# EAGLE design RC_prueba (EAGLE 7.1.0)
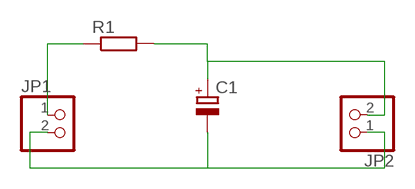
[diagram p0: schematic, sheet 1]

## Parts
C1  CPOL-EUA/3216-18R  [A/3216-18R]
JP1  PINHD-1X2  [1X02]
JP2  PINHD-1X2  [1X02]
R1  R-EU_MELF0204W  [MINI_MELF-0204W]

## Nets
N$1: JP1.1 R1.1
N$2: C1.+ JP2.2 R1.2
N$4: C1.- JP1.2 JP2.1

## Library data of the parts
C1 = rcl:CPOL-EU: POLARIZED CAPACITOR, European symbol
JP1 JP2 = pinhead:PINHD-1X2: PIN HEADER
R1 = rcl:R-EU_: RESISTOR, European symbol

## Board
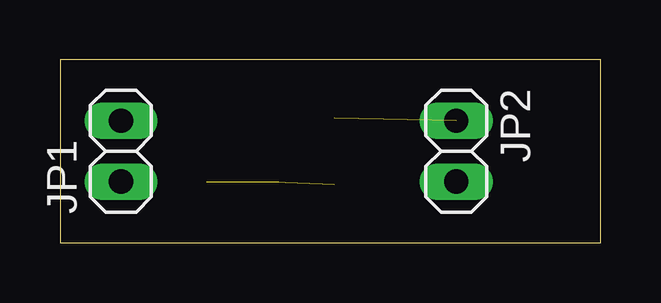
[diagram p1: board, top side]
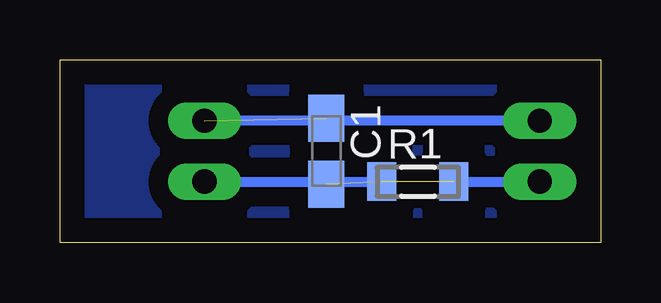
[diagram p2: board, bottom side, seen from below]

Size 22.53 x 7.61 mm. Coordinates in mm from the lower left corner, seen from the top.
Outline: 0,0 22.53,0 22.53,7.61 0,7.61 0,0
Copper layers (1*16): Top 0.035mm / dielectric 1.5mm / Bottom 0.035mm
Design rules "default": minimum track width 10mil, minimum drill 24mil, track to track 8mil, track to pad 8mil, pad to pad 8mil, via to via 8mil, smd to smd 8mil, copper to edge 40mil, drill to drill 8mil, minimum pad ring 10mil, minimum via ring 8mil, stop-mask expansion 4mil, vias tented up to drill 0mil, thermal gap 10mil

### Footprints (pad centres in the part's own frame; a part is rotated, then mirrored left to right if it is on the bottom)
A/3216-18R = smd 1.95 x 1.5: + 1.375,0; - -1.375,0
1X02 = drill 1.016 long: 1 -1.27,0; 2 1.27,0
MINI_MELF-0204W = smd 1.2 x 1.6: 1 -1.5,0; 2 1.5,0

### Placement (x,y rotation side)
C1  11.43,3.81 270 bottom
JP1  2.54,3.81 90 top
JP2  16.51,3.81 270 top
R1  7.62,2.54 0 bottom

### Tracks (layer width: path | path; a pad name or v marks a point on that pad's centre or on a via)
N$1  (1 unrouted)
  Bottom 0.406: 6.35,2.54 JP1.1
N$2  (2 unrouted)
  Bottom 0.406: JP2.2 8.89,2.54
N$4  (1 unrouted)
  Bottom 0.406: JP1.2 JP2.1
N$5
  pour Bottom (isolate 0.813): 0,7.62 0,0 22.86,0 22.86,7.62